# EAGLE schematic Trinket_TH_thru_parts_power_breakout (EAGLE 7.2.0)
Trinket_TH_thru_parts_power_breakout

## Sheet 1 of 8: Trinket_TH_thru_parts_power_breakout
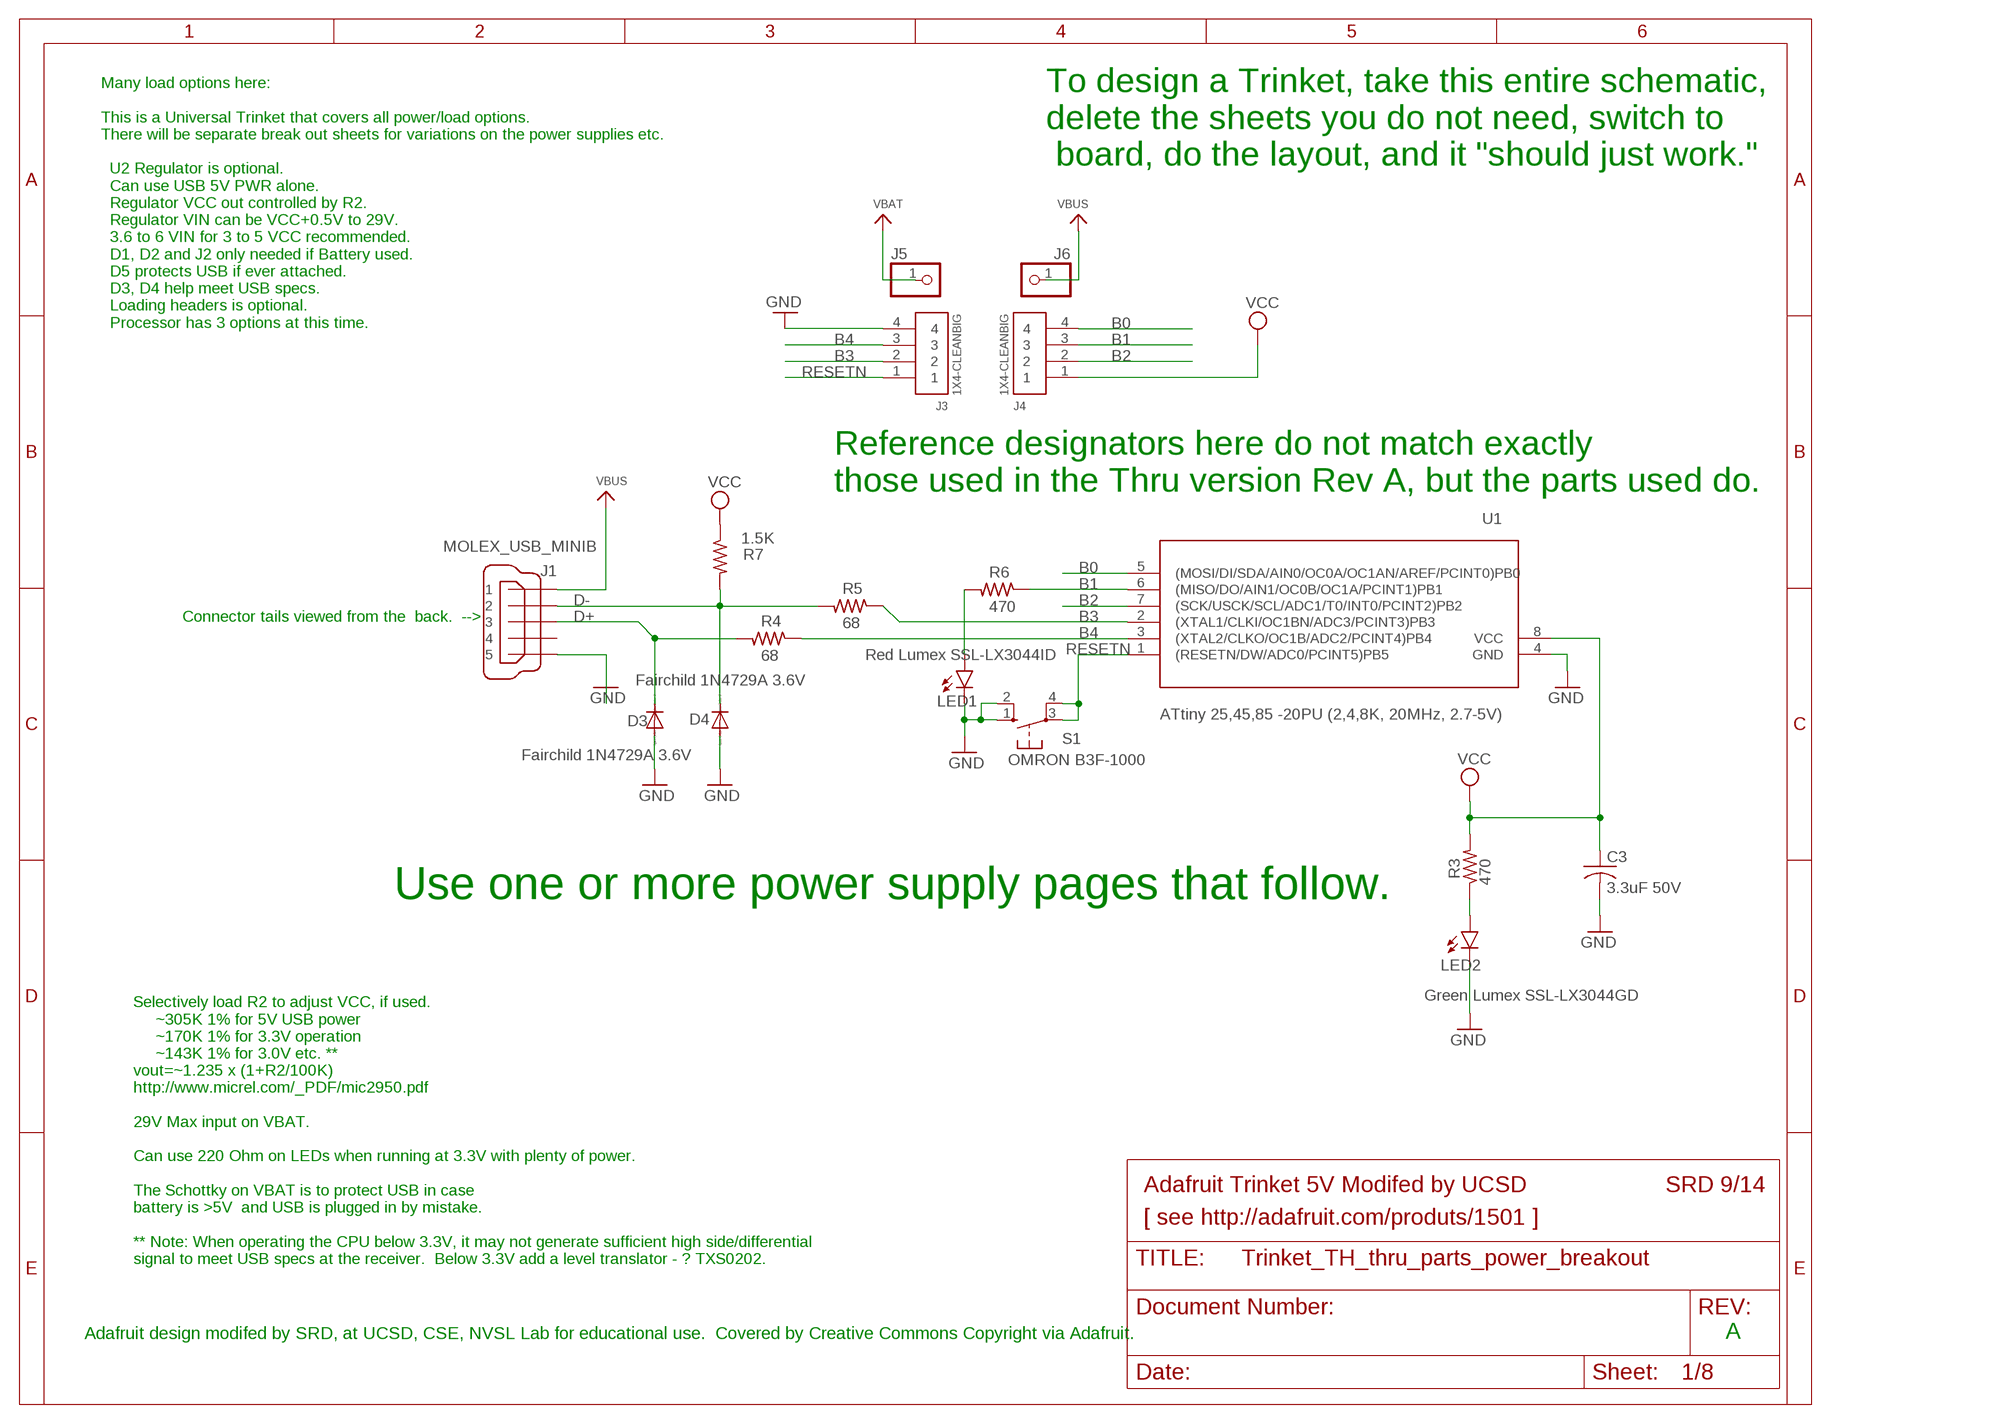
[diagram p0: schematic, sheet 1]

### Parts
C3  3.3uF 50V  C-US050-025X075  [C050-025X075]
D3  Fairchild 1N4729A 3.6V  DIODE-DO41-7.6  [DO41-7.6]
D4  Fairchild 1N4729A 3.6V  DIODE-DO41-7.6  [DO41-7.6]
J1  MOLEX_USB_MINIB  [32005-601-ROUND]
J3  1X4-CLEANBIG  [1X04-CLEANBIG]
J4  1X4-CLEANBIG  [1X04-CLEANBIG]
J5  PINHD-1X1CB  [1X01-CLEANBIG]
J6  PINHD-1X1CB  [1X01-CLEANBIG]
LED1  Red Lumex SSL-LX3044ID  LED3MM  [LED3MM]
LED2  Green Lumex SSL-LX3044GD  LED3MM  [LED3MM]
R3  470  R-US_0204/7  [0204/7]
R4  68  R-US_0204/7  [0204/7]
R5  68  R-US_0204/7  [0204/7]
R6  470  R-US_0204/7  [0204/7]
R7  1.5K  R-US_0204/7  [0204/7]
S1  OMRON B3F-1000  10-XX  [B3F-10XX]
U1  ATtiny 25,45,85 -20PU (2,4,8K, 20MHz, 2.7-5V)  ATTINY85-20P  [DIL08]

### Nets
B0: J4.4 U1.5((MOSI/DI/SDA/AIN0/OC0A/OC1AN/AREF/PCINT0)PB0)
B1: J4.3 R6.1 U1.6((MISO/DO/AIN1/OC0B/OC1A/PCINT1)PB1)
B2: J4.2 U1.7((SCK/USCK/SCL/ADC1/T0/INT0/PCINT2)PB2)
B3: J3.2 R5.1 U1.2((XTAL1/CLKI/OC1BN/ADC3/PCINT3)PB3)
B4: J3.3 R4.1 U1.3((XTAL2/CLKO/OC1B/ADC2/PCINT4)PB4)
D+: D3.C J1.3 R4.2
D-: D4.C J1.2 R5.2 R7.2
GND: C3.2 D3.A D4.A J1.5 J3.4 LED1.K(C) LED2.K(C) S1.1(S) S1.2(S1) U1.4(GND) ; also sheet 3,7,8
N$1: LED1.A R6.2
N$3: LED2.A R3.1
RESETN: J3.1 S1.3(P) S1.4(P1) U1.1((RESETN/DW/ADC0/PCINT5)PB5)
VBAT: J5.1 ; also sheet 2,3,8
VBUS: J1.1 J6.1 ; also sheet 3,7,8
VCC: C3.1 J4.1 R3.2 R7.1 U1.8(VCC) ; also sheet 2,3,4,5,6,7,8
Unconnected: J1.4 J1.M1(S1) J1.M2(S2)

### Notes on the sheet
- To design a Trinket, take this entire schematic,
  delete the sheets you do not need, switch to
   board, do the layout, and it "should just work."
- Many load options here:
  
  This is a Universal Trinket that covers all power/load options.
  There will be separate break out sheets for variations on the power supplies etc.
  
    U2 Regulator is optional.  
    Can use USB 5V PWR alone.
    Regulator VCC out controlled by R2.
    Regulator VIN can be VCC+0.5V to 29V.
    3.6 to 6 VIN for 3 to 5 VCC recommended.
    D1, D2 and J2 only needed if Battery used.
    D5 protects USB if ever attached.
    D3, D4 help meet USB specs.
    Loading headers is optional.
    Processor has 3 options at this time.
- Reference designators here do not match exactly
  those used in the Thru version Rev A, but the parts used do.
- Connector tails viewed from the  back.  -->
- Use one or more power supply pages that follow.
- Adafruit Trinket 5V Modifed by UCSD | SRD 9/14
- [ see http://adafruit.com/produts/1501 ]
- Selectively load R2 to adjust VCC, if used.
       ~305K 1% for 5V USB power
       ~170K 1% for 3.3V operation
       ~143K 1% for 3.0V etc. **
  vout=~1.235 x (1+R2/100K)
  http://www.micrel.com/_PDF/mic2950.pdf
  
  29V Max input on VBAT.
  
  Can use 220 Ohm on LEDs when running at 3.3V with plenty of power.
  
  The Schottky on VBAT is to protect USB in case 
  battery is >5V  and USB is plugged in by mistake.
  
  ** Note: When operating the CPU below 3.3V, it may not generate sufficient high side/differential
  signal to meet USB specs at the receiver.  Below 3.3V add a level translator - ? TXS0202.
- Adafruit design modifed by SRD, at UCSD, CSE, NVSL Lab for educational use.  Covered by Creative Commons Copyright via Adafruit. | A

## Sheet 2 of 8
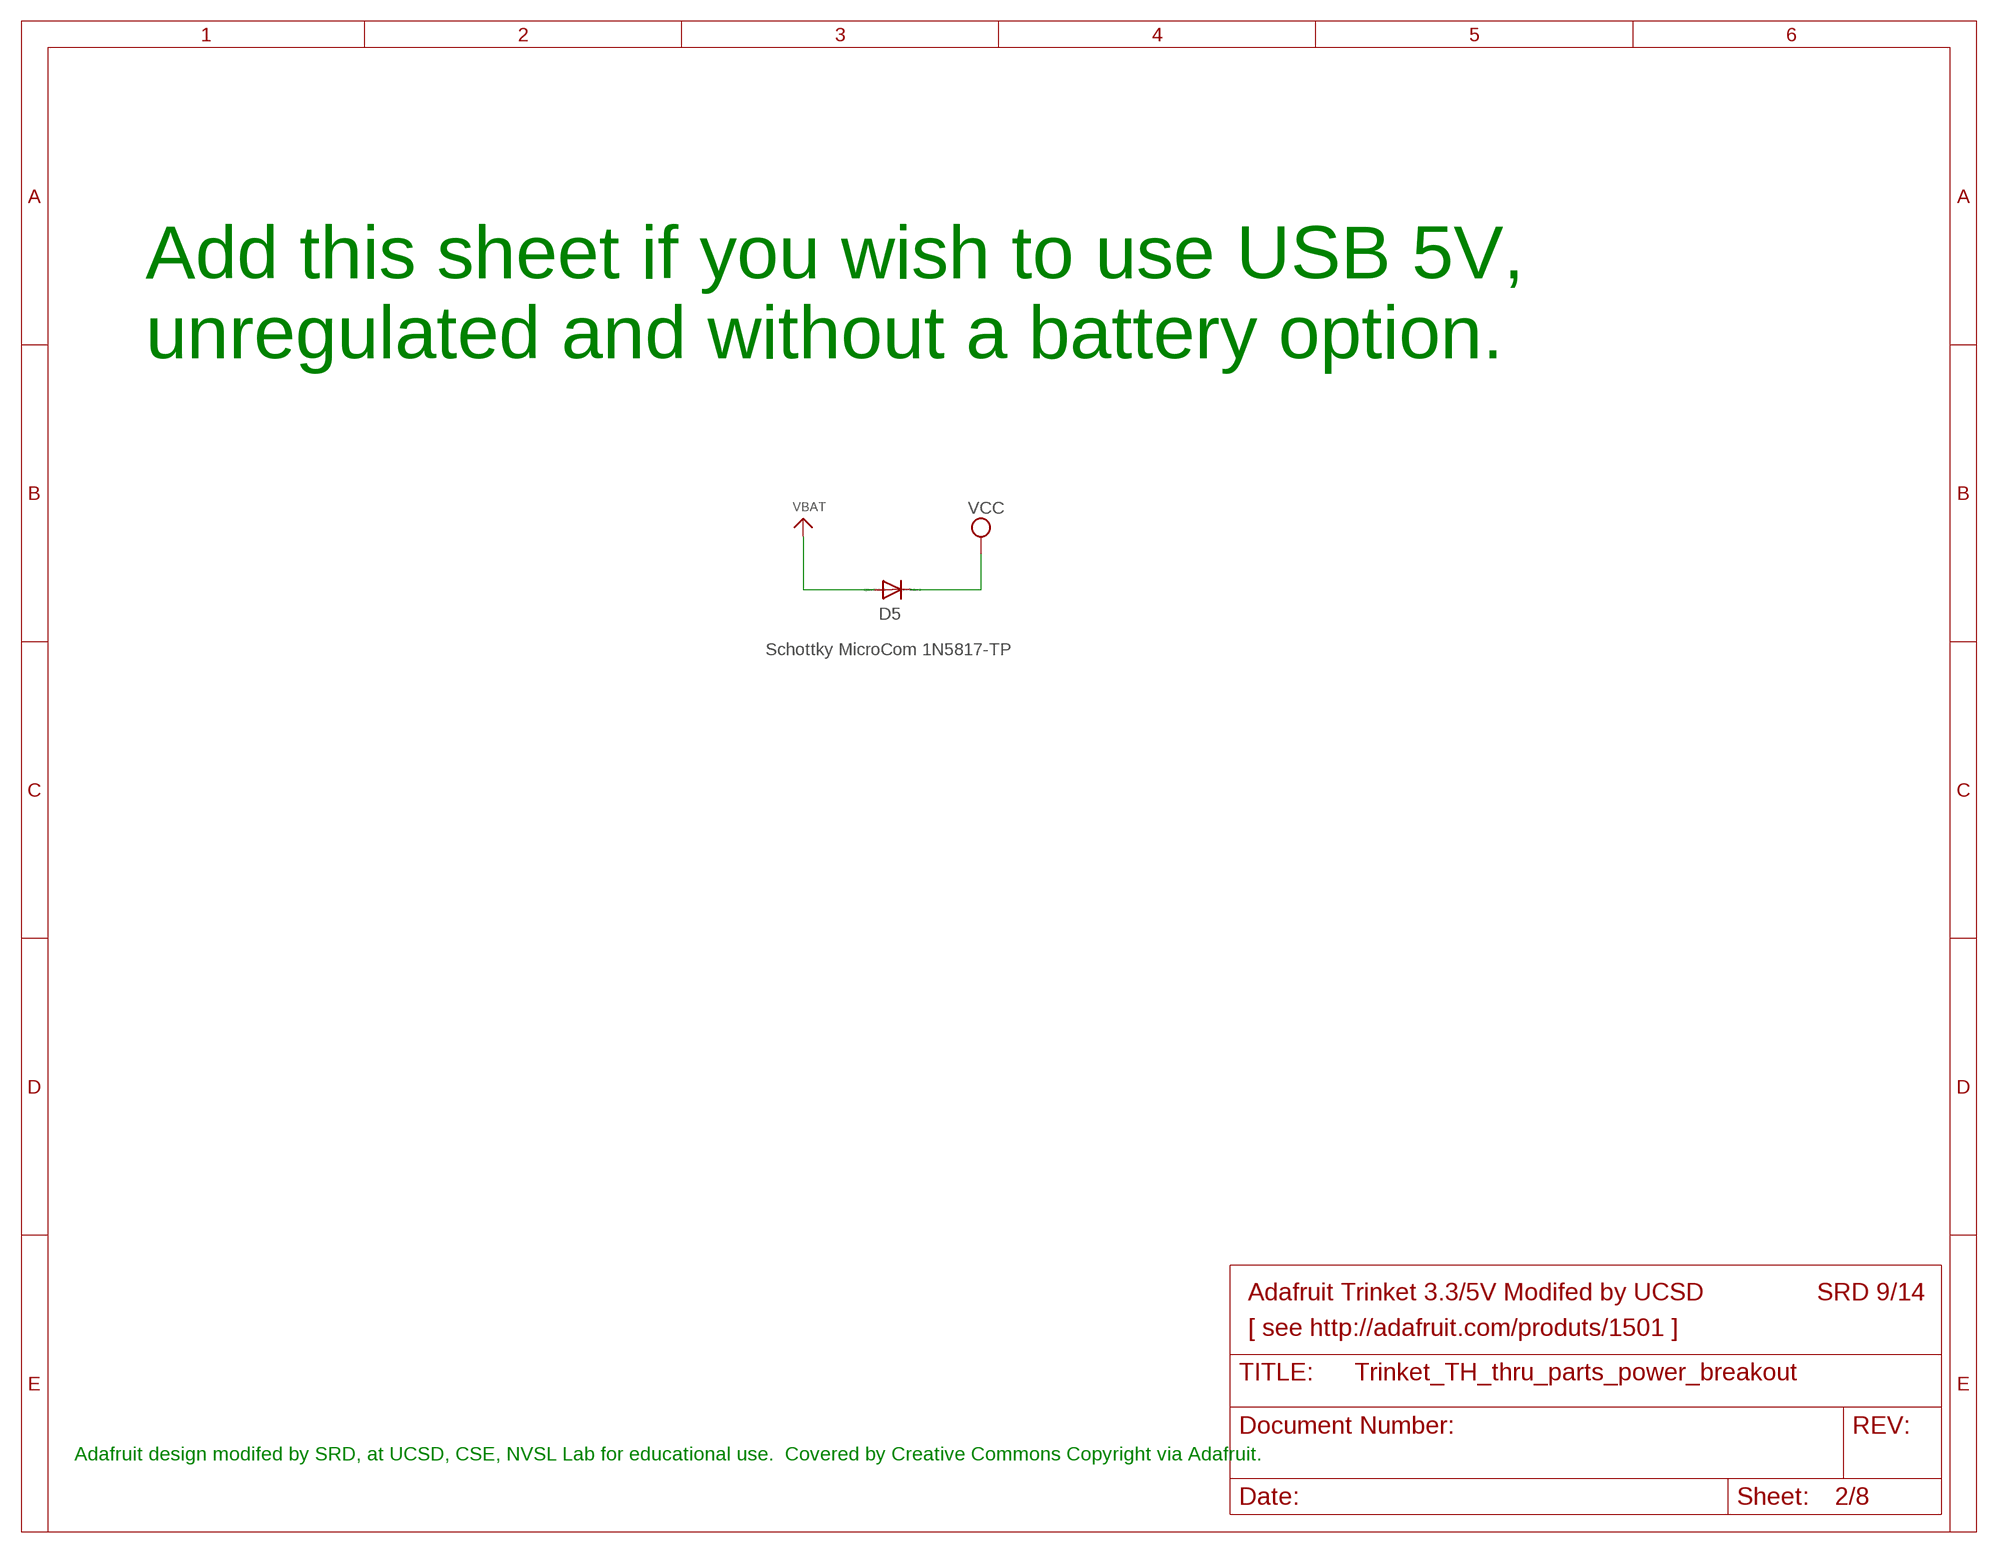
[diagram p1: schematic, sheet 2]

### Parts
D5  Schottky MicroCom 1N5817-TP  DIODE-DO41-7.6  [DO41-7.6]

### Nets
VBAT: D5.A ; also sheet 1,3,8
VCC: D5.C ; also sheet 1,3,4,5,6,7,8

### Notes on the sheet
- Add this sheet if you wish to use USB 5V,
  unregulated and without a battery option.
- Adafruit Trinket 3.3/5V Modifed by UCSD | SRD 9/14
- [ see http://adafruit.com/produts/1501 ]
- Adafruit design modifed by SRD, at UCSD, CSE, NVSL Lab for educational use.  Covered by Creative Commons Copyright via Adafruit.

## Sheet 3 of 8
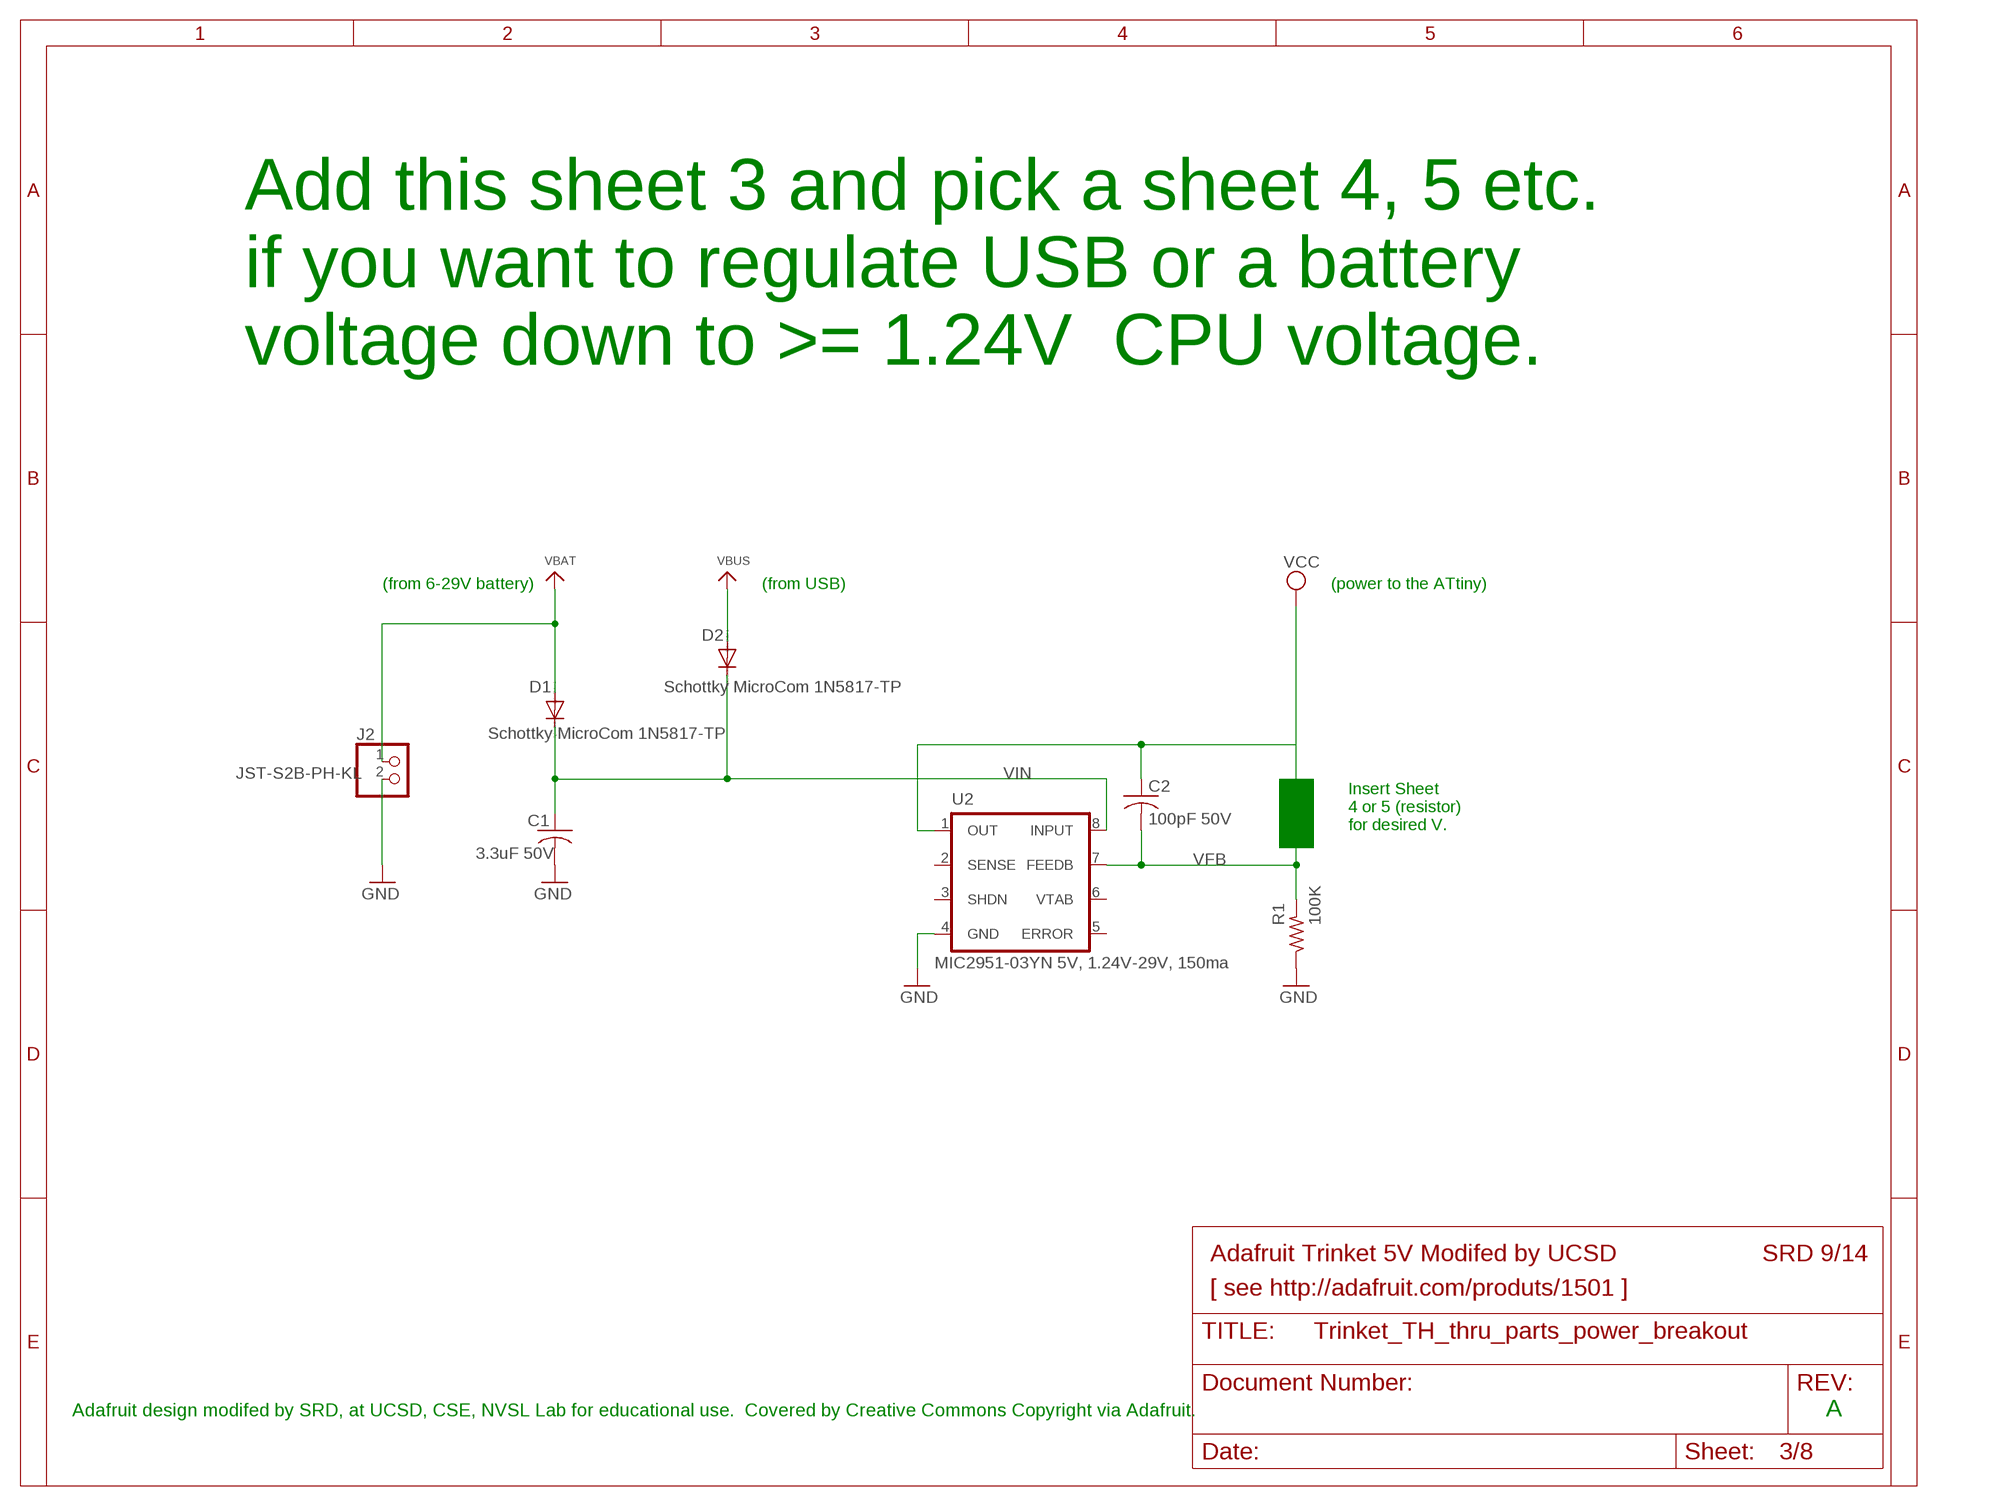
[diagram p2: schematic, sheet 3]

### Parts
C1  3.3uF 50V  C-US050-025X075  [C050-025X075]
C2  100pF 50V  C-US050-025X075  [C050-025X075]
D1  Schottky MicroCom 1N5817-TP  DIODE-DO41-7.6  [DO41-7.6]
D2  Schottky MicroCom 1N5817-TP  DIODE-DO41-7.6  [DO41-7.6]
J2  JST-S2B-PH-KL  CON_JST_PH_2PINJST_S2B_PH_KL  [JST_S2B_PH_KL]
R1  100K  R-US_0204/7  [0204/7]
U2  MIC2951-03YN 5V, 1.24V-29V, 150ma  MIC2951-03YNCN  [DIL08]

### Nets
GND: C1.2 J2.2 R1.1 U2.4(GND) ; also sheet 1,7,8
VBAT: D1.A J2.1 ; also sheet 1,2,8
VBUS: D2.A ; also sheet 1,7,8
VCC: C2.1 U2.1(OUT) ; also sheet 1,2,4,5,6,7,8
VFB: C2.2 R1.2 U2.7(FEEDB) ; also sheet 4,5,6,7,8
VIN: C1.1 D1.C D2.C U2.8(INPUT) ; also sheet 7,8
Unconnected: U2.2(SENSE) U2.3(SHDN) U2.5(ERROR) U2.6(VTAB)

### Notes on the sheet
- Add this sheet 3 and pick a sheet 4, 5 etc.
  if you want to regulate USB or a battery
  voltage down to >= 1.24V  CPU voltage.
- (from 6-29V battery) | (from USB) | (power to the ATtiny)
- Insert Sheet
  4 or 5 (resistor)
  for desired V.
- Adafruit Trinket 5V Modifed by UCSD | SRD 9/14
- [ see http://adafruit.com/produts/1501 ]
- Adafruit design modifed by SRD, at UCSD, CSE, NVSL Lab for educational use.  Covered by Creative Commons Copyright via Adafruit. | A

## Sheet 4 of 8
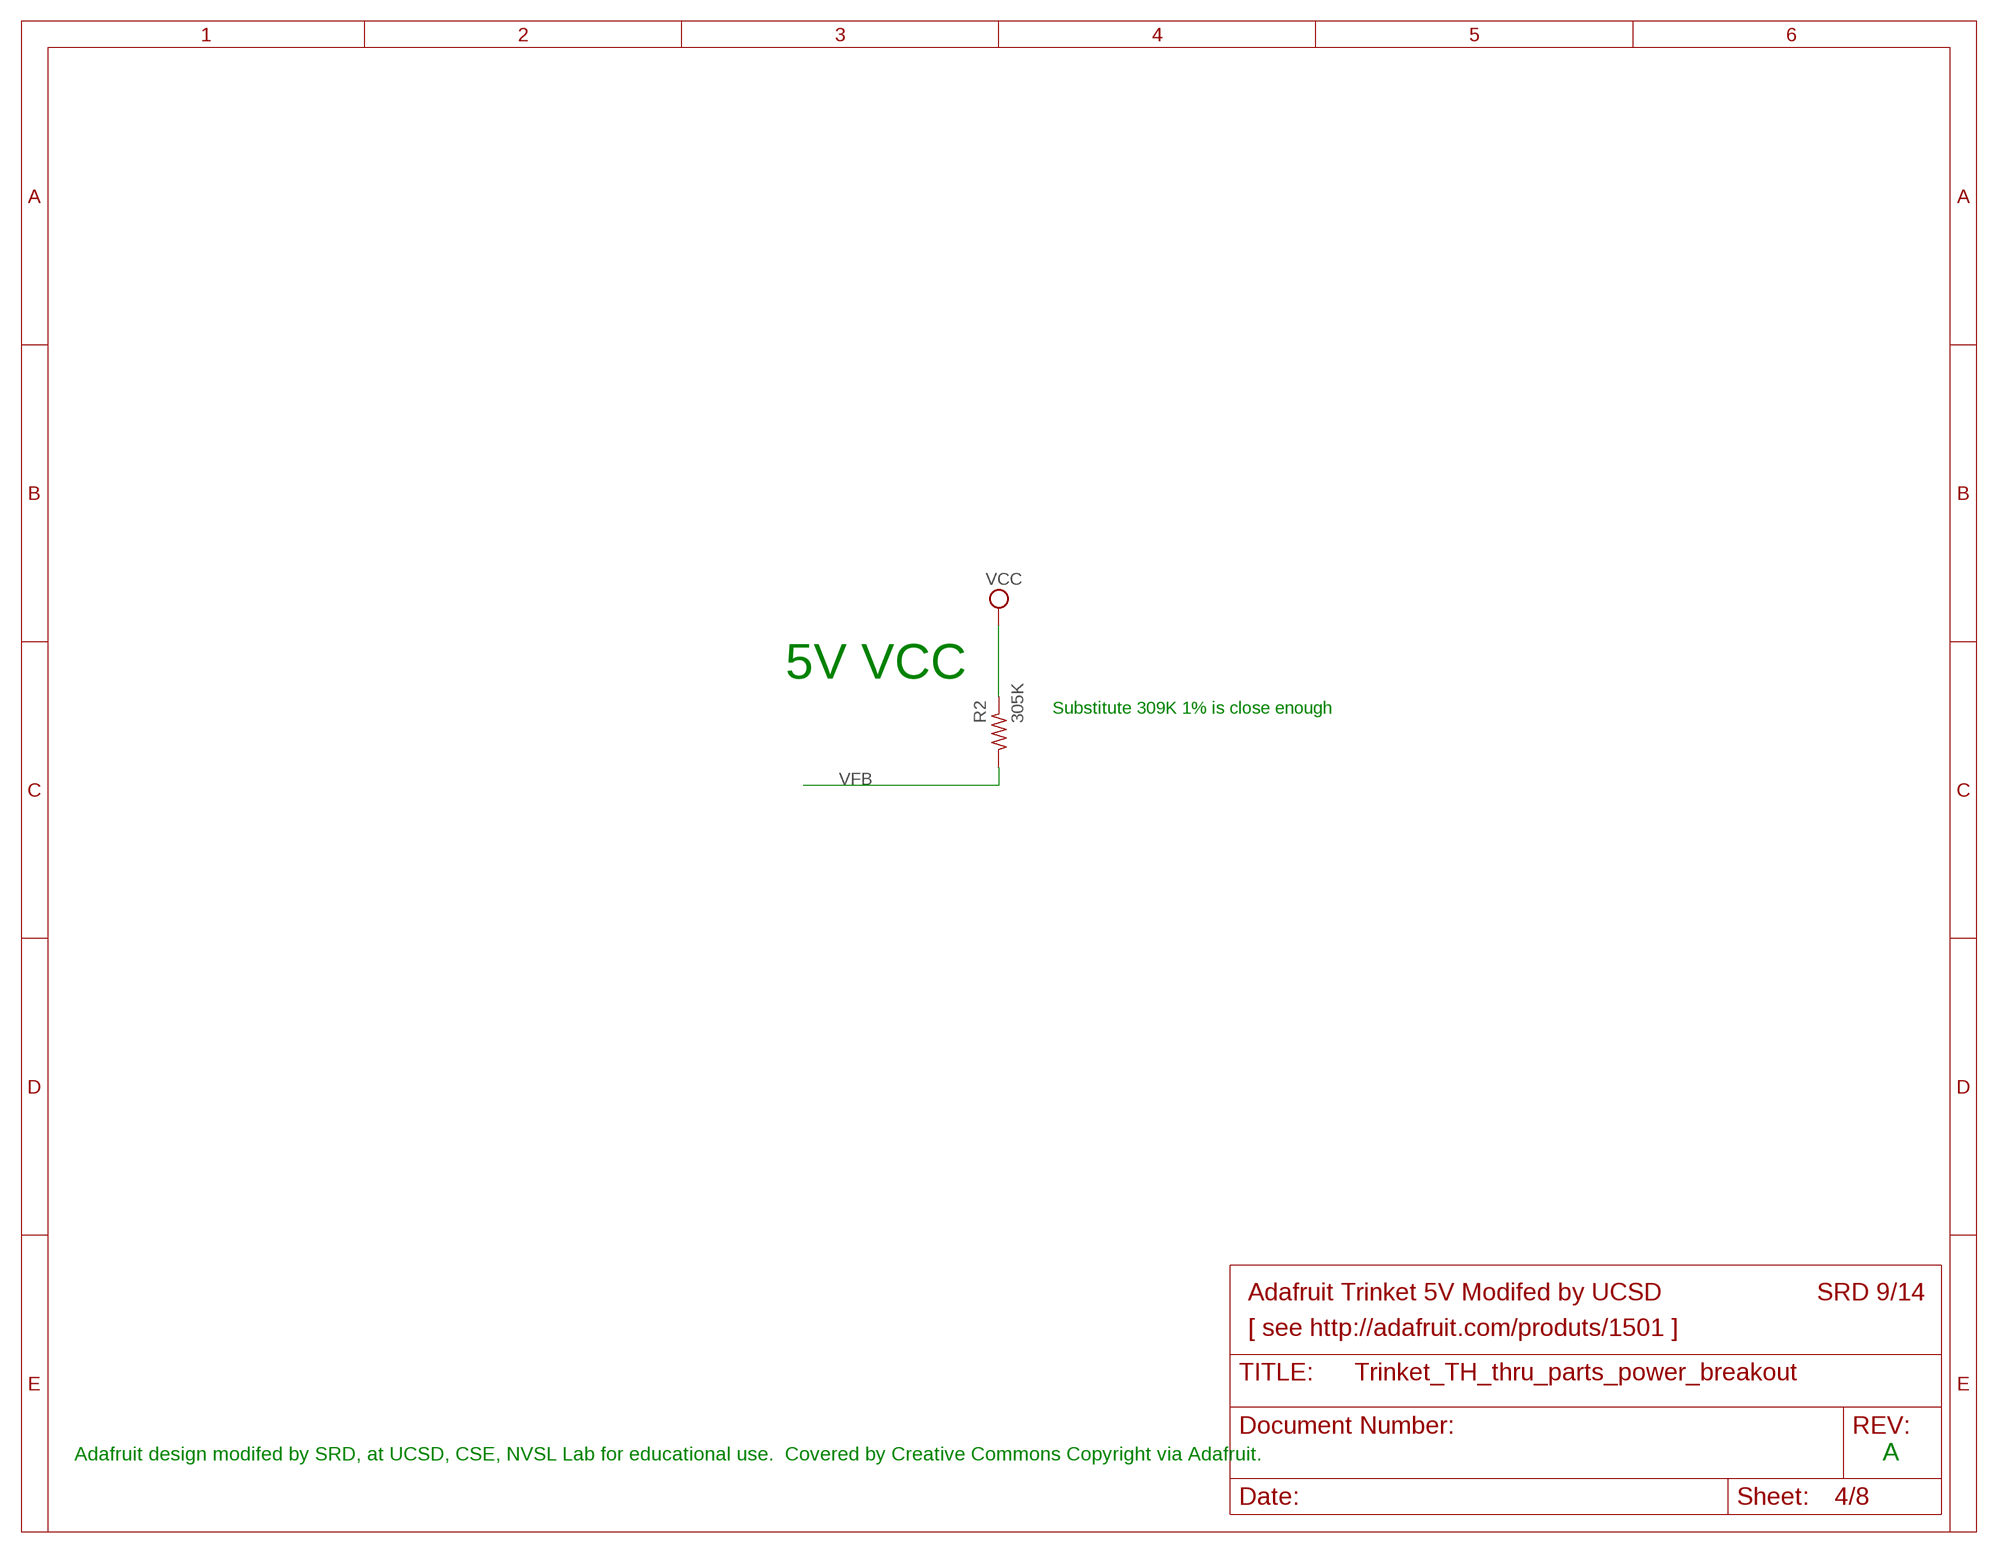
[diagram p3: schematic, sheet 4]

### Parts
R2  305K  R-US_0204/7  [0204/7]

### Nets
VCC: R2.2 ; also sheet 1,2,3,5,6,7,8
VFB: R2.1 ; also sheet 3,5,6,7,8

### Notes on the sheet
- 5V VCC
- Substitute 309K 1% is close enough
- Adafruit Trinket 5V Modifed by UCSD | SRD 9/14
- [ see http://adafruit.com/produts/1501 ]
- Adafruit design modifed by SRD, at UCSD, CSE, NVSL Lab for educational use.  Covered by Creative Commons Copyright via Adafruit. | A

## Sheet 5 of 8
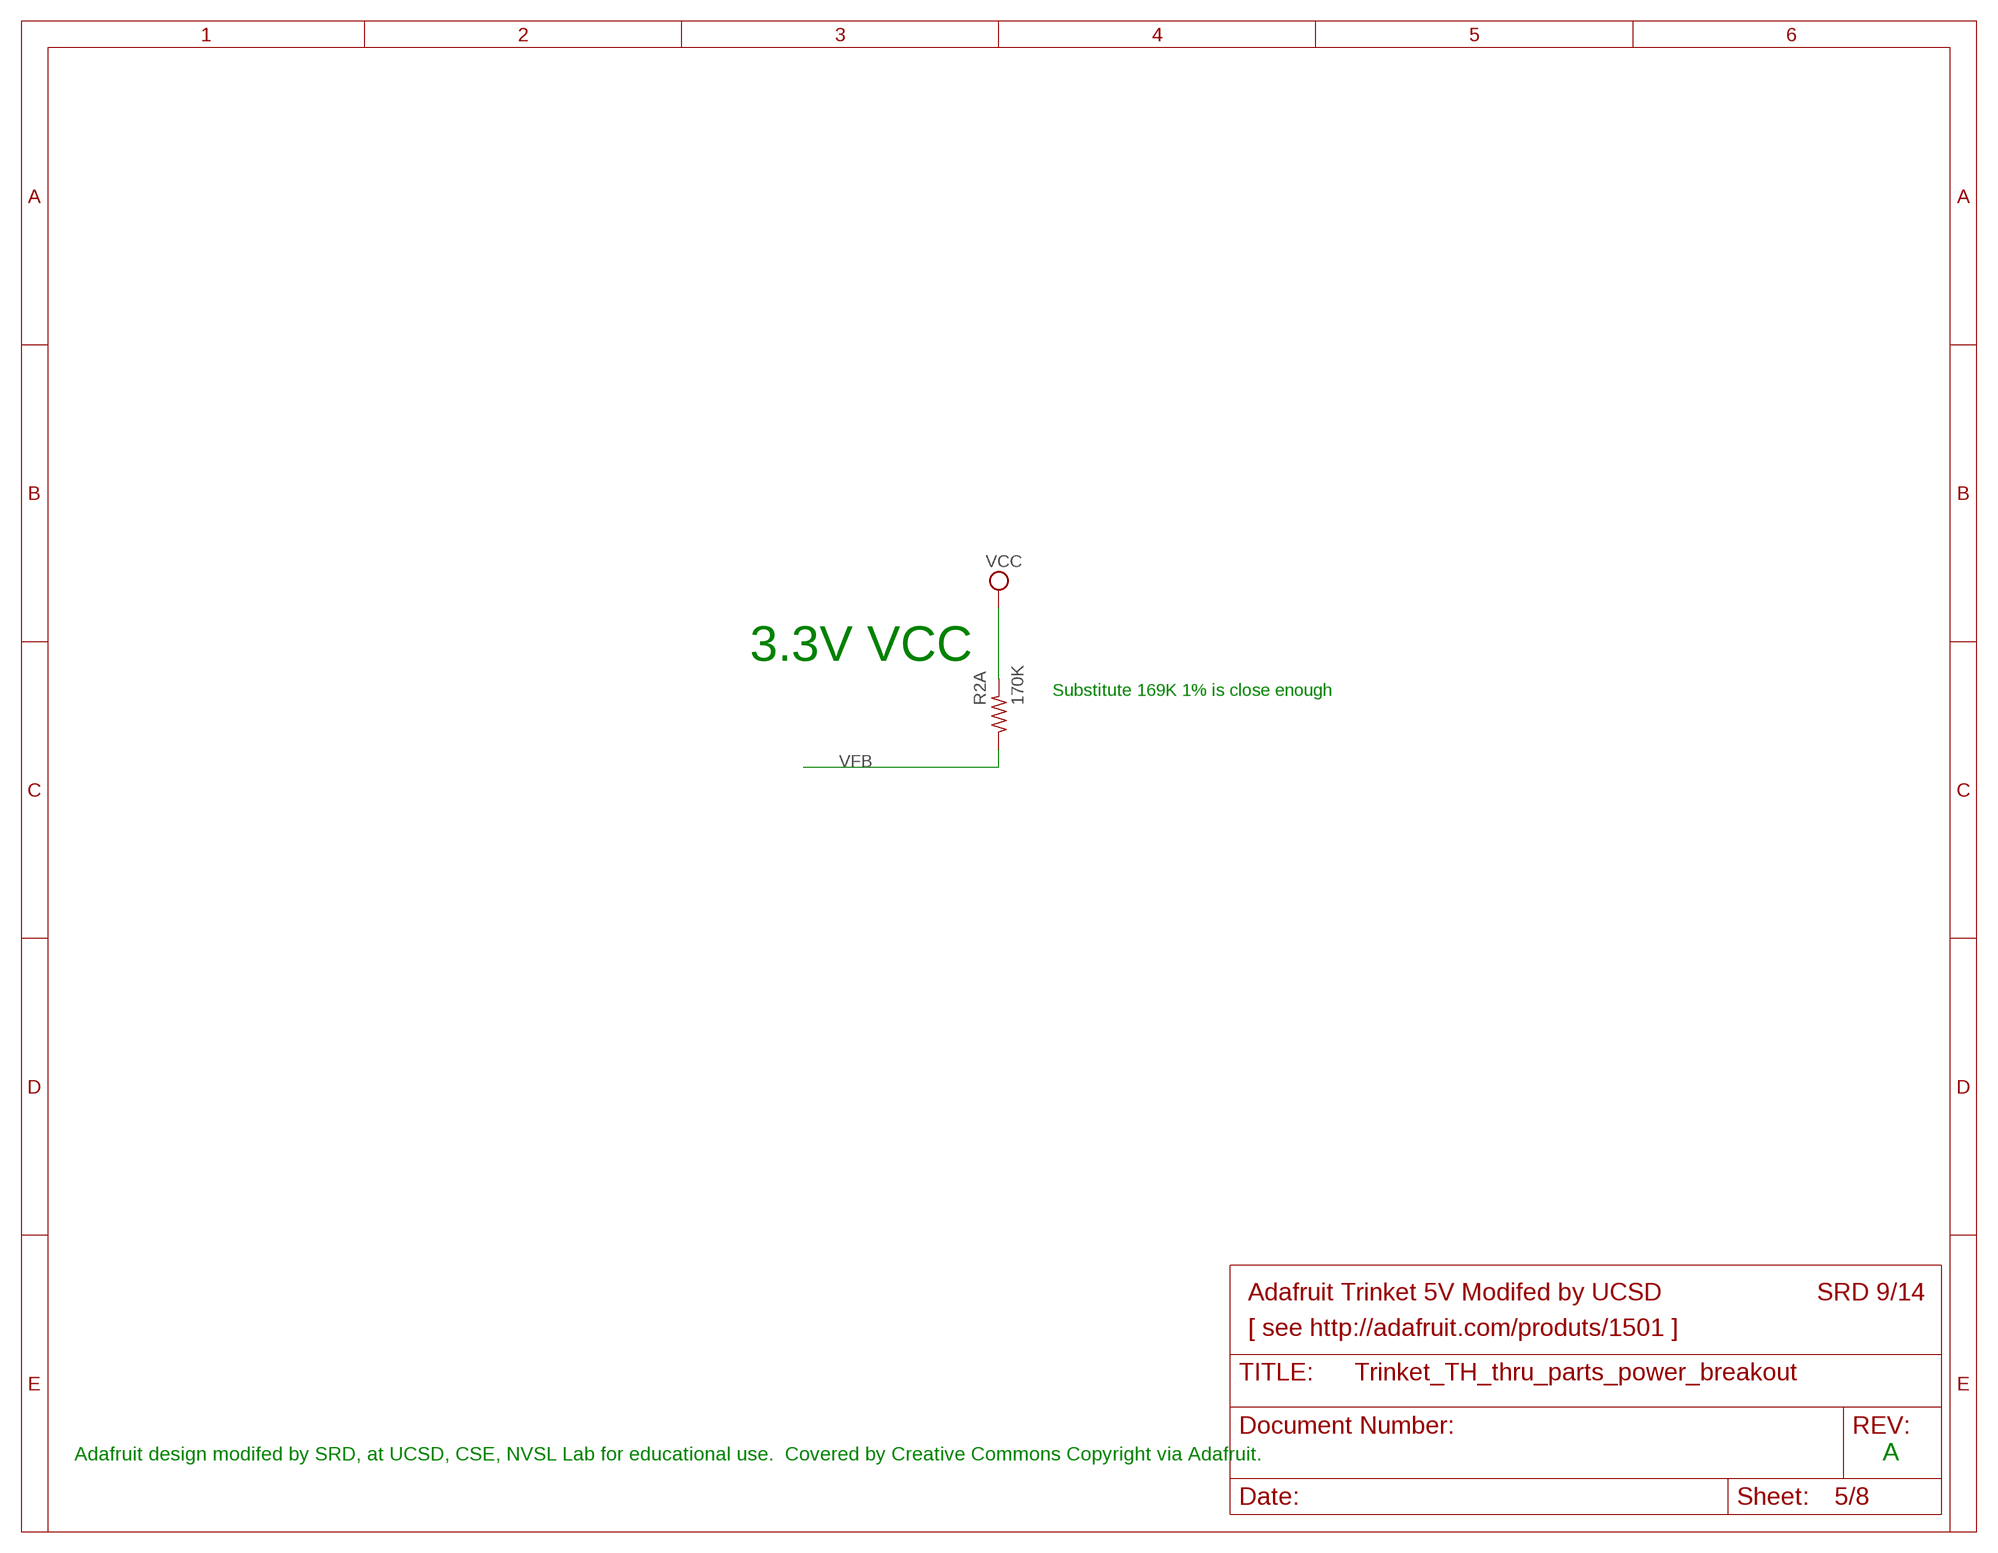
[diagram p4: schematic, sheet 5]

### Parts
R2A  170K  R-US_0204/7  [0204/7]

### Nets
VCC: R2A.2 ; also sheet 1,2,3,4,6,7,8
VFB: R2A.1 ; also sheet 3,4,6,7,8

### Notes on the sheet
- 3.3V VCC
- Substitute 169K 1% is close enough
- Adafruit Trinket 5V Modifed by UCSD | SRD 9/14
- [ see http://adafruit.com/produts/1501 ]
- Adafruit design modifed by SRD, at UCSD, CSE, NVSL Lab for educational use.  Covered by Creative Commons Copyright via Adafruit. | A

## Sheet 6 of 8
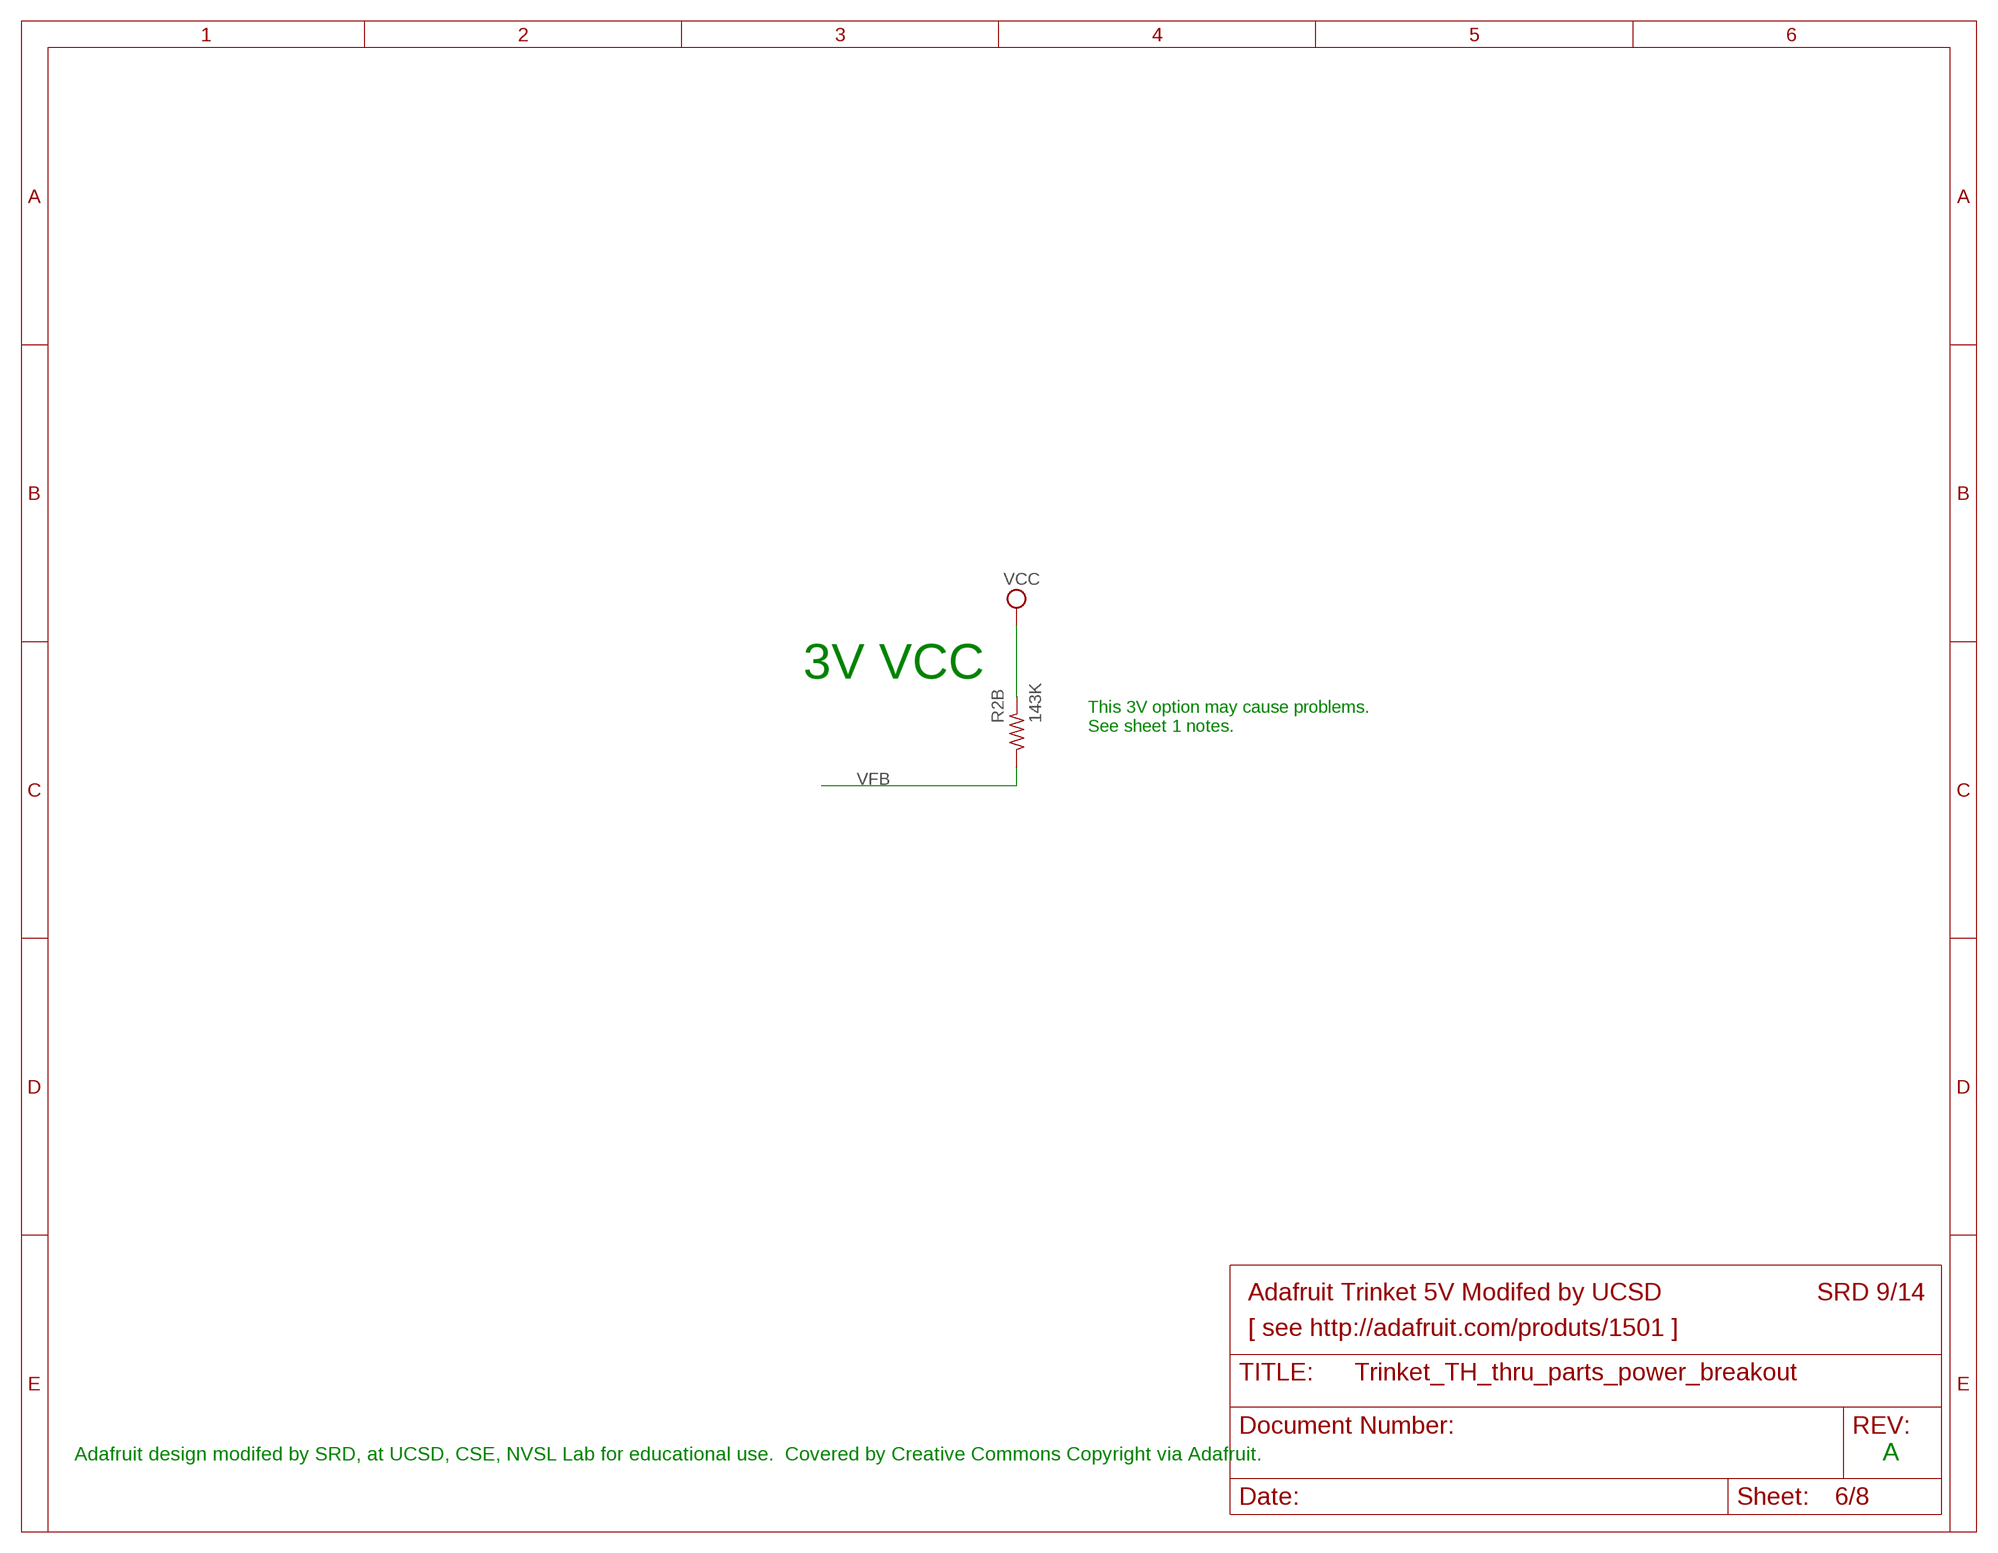
[diagram p5: schematic, sheet 6]

### Parts
R2B  143K  R-US_0204/7  [0204/7]

### Nets
VCC: R2B.2 ; also sheet 1,2,3,4,5,7,8
VFB: R2B.1 ; also sheet 3,4,5,7,8

### Notes on the sheet
- 3V VCC
- This 3V option may cause problems.
  See sheet 1 notes.
- Adafruit Trinket 5V Modifed by UCSD | SRD 9/14
- [ see http://adafruit.com/produts/1501 ]
- Adafruit design modifed by SRD, at UCSD, CSE, NVSL Lab for educational use.  Covered by Creative Commons Copyright via Adafruit. | A

## Sheet 7 of 8
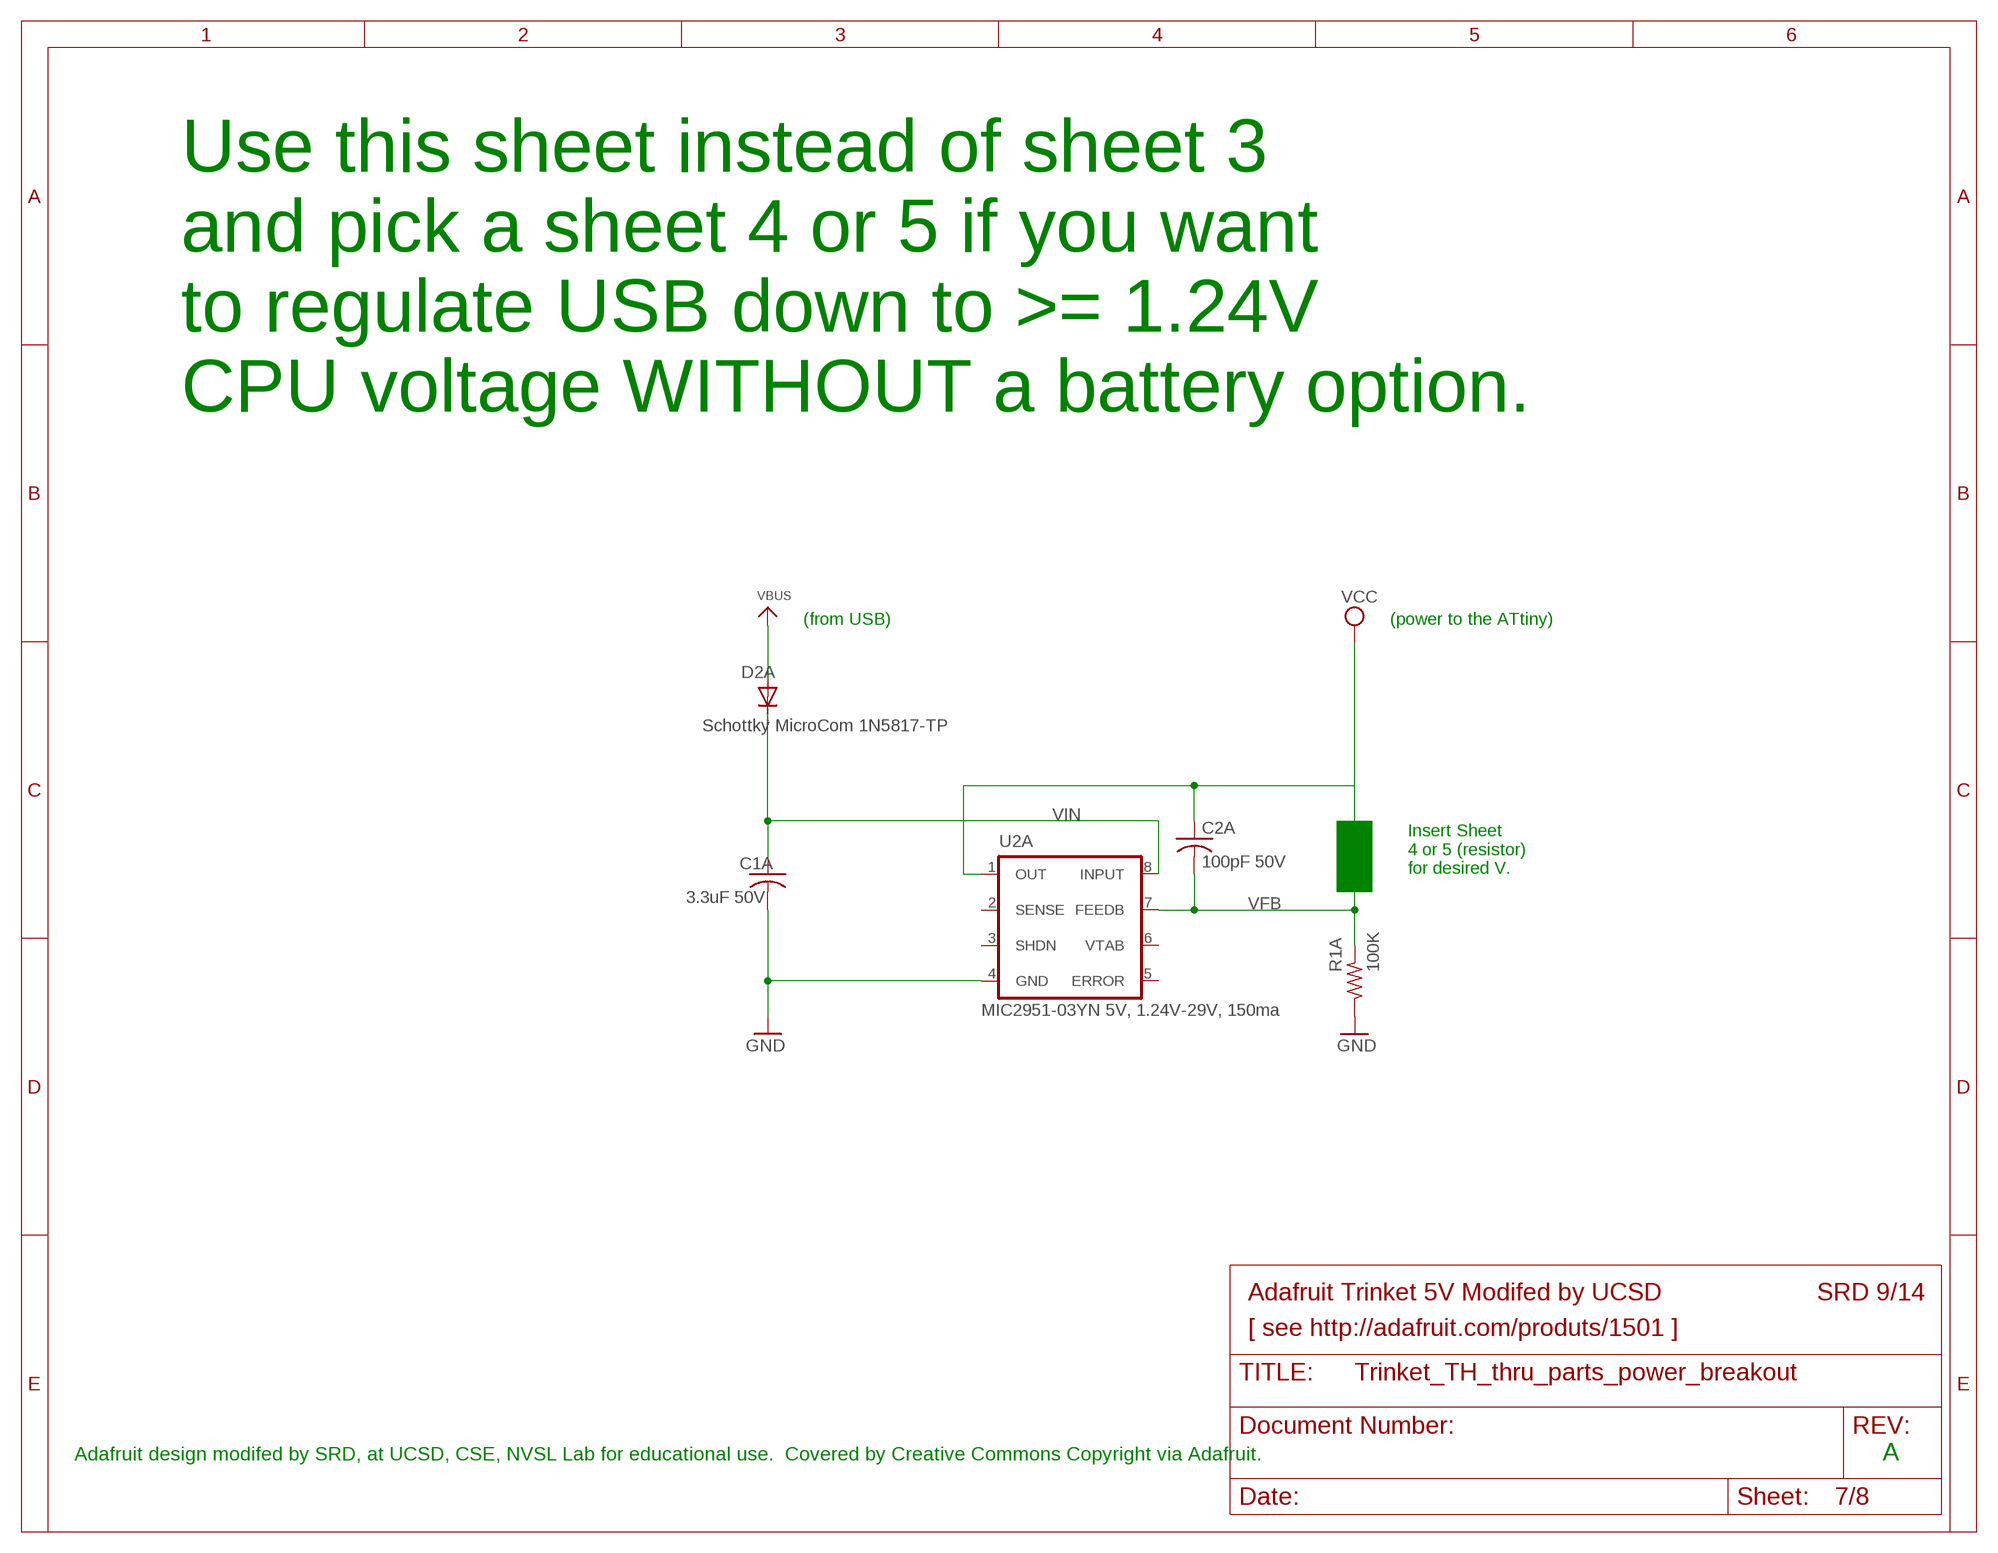
[diagram p6: schematic, sheet 7]

### Parts
C1A  3.3uF 50V  C-US050-025X075  [C050-025X075]
C2A  100pF 50V  C-US050-025X075  [C050-025X075]
D2A  Schottky MicroCom 1N5817-TP  DIODE-DO41-7.6  [DO41-7.6]
R1A  100K  R-US_0204/7  [0204/7]
U2A  MIC2951-03YN 5V, 1.24V-29V, 150ma  MIC2951-03YNCN  [DIL08]

### Nets
GND: C1A.2 R1A.1 U2A.4(GND) ; also sheet 1,3,8
VBUS: D2A.A ; also sheet 1,3,8
VCC: C2A.1 U2A.1(OUT) ; also sheet 1,2,3,4,5,6,8
VFB: C2A.2 R1A.2 U2A.7(FEEDB) ; also sheet 3,4,5,6,8
VIN: C1A.1 D2A.C U2A.8(INPUT) ; also sheet 3,8
Unconnected: U2A.2(SENSE) U2A.3(SHDN) U2A.5(ERROR) U2A.6(VTAB)

### Notes on the sheet
- Use this sheet instead of sheet 3
  and pick a sheet 4 or 5 if you want 
  to regulate USB down to >= 1.24V 
  CPU voltage WITHOUT a battery option.
- (from USB) | (power to the ATtiny)
- Insert Sheet
  4 or 5 (resistor)
  for desired V.
- Adafruit Trinket 5V Modifed by UCSD | SRD 9/14
- [ see http://adafruit.com/produts/1501 ]
- Adafruit design modifed by SRD, at UCSD, CSE, NVSL Lab for educational use.  Covered by Creative Commons Copyright via Adafruit. | A

## Sheet 8 of 8
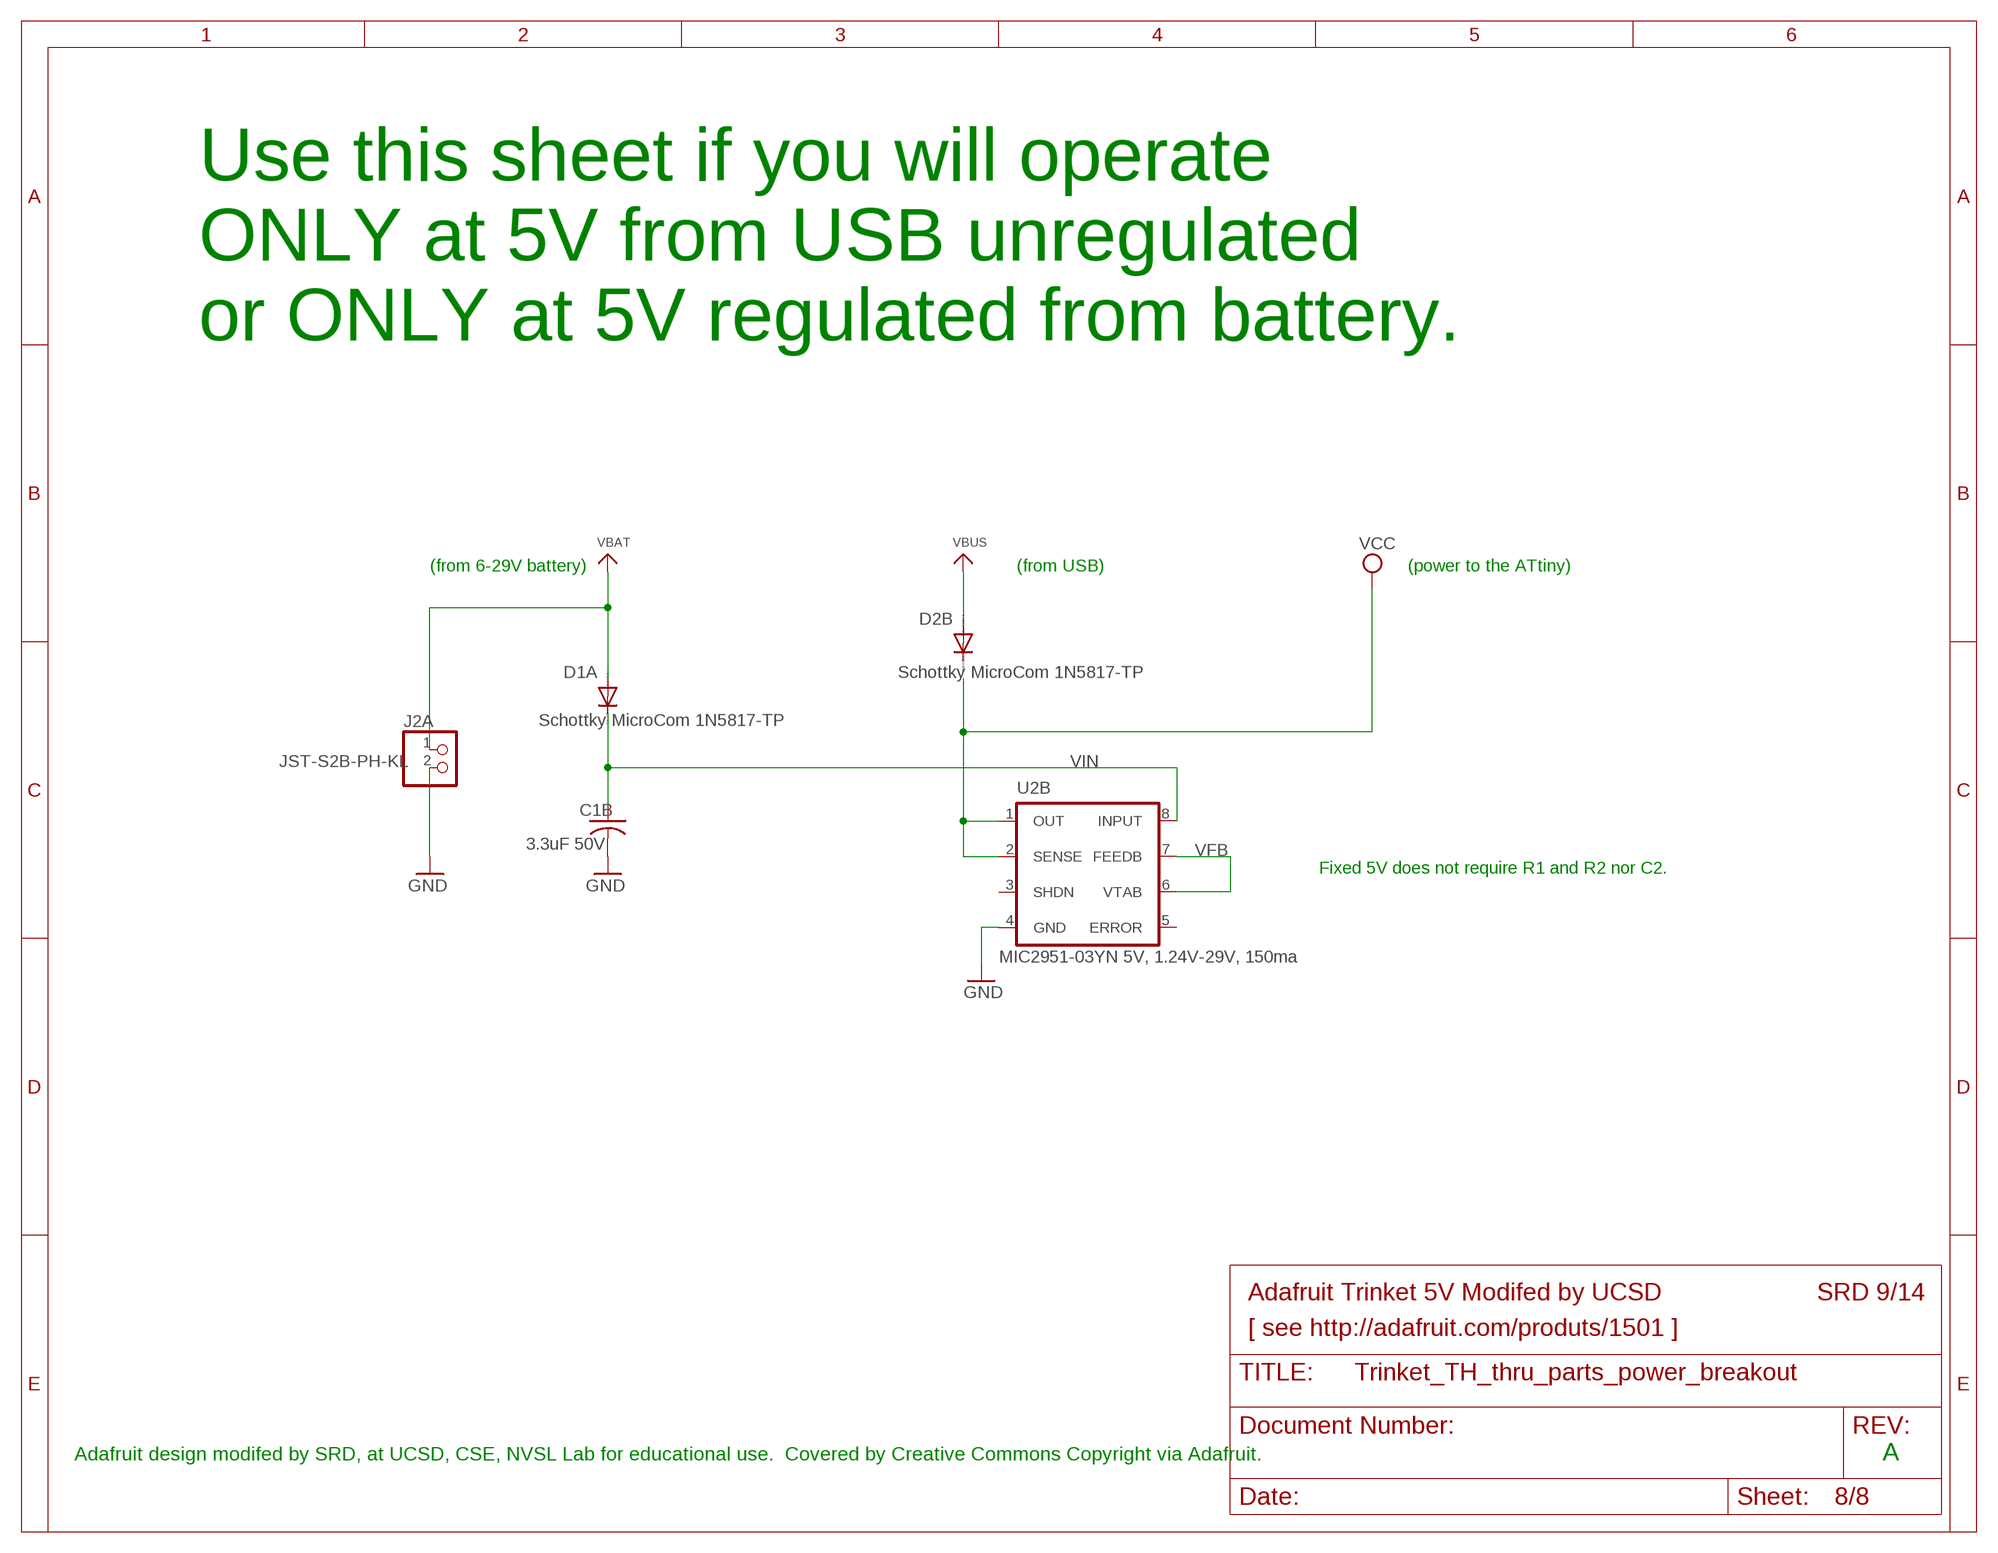
[diagram p7: schematic, sheet 8]

### Parts
C1B  3.3uF 50V  C-US050-025X075  [C050-025X075]
D1A  Schottky MicroCom 1N5817-TP  DIODE-DO41-7.6  [DO41-7.6]
D2B  Schottky MicroCom 1N5817-TP  DIODE-DO41-7.6  [DO41-7.6]
J2A  JST-S2B-PH-KL  CON_JST_PH_2PINJST_S2B_PH_KL  [JST_S2B_PH_KL]
U2B  MIC2951-03YN 5V, 1.24V-29V, 150ma  MIC2951-03YNCN  [DIL08]

### Nets
GND: C1B.2 J2A.2 U2B.4(GND) ; also sheet 1,3,7
VBAT: D1A.A J2A.1 ; also sheet 1,2,3
VBUS: D2B.A ; also sheet 1,3,7
VCC: U2B.1(OUT) U2B.2(SENSE) ; also sheet 1,2,3,4,5,6,7
VFB: U2B.6(VTAB) U2B.7(FEEDB) ; also sheet 3,4,5,6,7
VIN: C1B.1 D1A.C U2B.8(INPUT) ; also sheet 3,7
Unconnected: D2B.C U2B.3(SHDN) U2B.5(ERROR)

### Notes on the sheet
- Use this sheet if you will operate
  ONLY at 5V from USB unregulated
  or ONLY at 5V regulated from battery.
- (from 6-29V battery) | (from USB) | (power to the ATtiny)
- Fixed 5V does not require R1 and R2 nor C2.
- Adafruit Trinket 5V Modifed by UCSD | SRD 9/14
- [ see http://adafruit.com/produts/1501 ]
- Adafruit design modifed by SRD, at UCSD, CSE, NVSL Lab for educational use.  Covered by Creative Commons Copyright via Adafruit. | A

## Library data of the parts
C1 C1A C1B C3 = resistor:C-US: CAPACITOR, American symbol; DIST-1: DigiKey; DIST-1-PN: 445-8459-ND; MFR: TDK; PARTNO: FK20X7R1H335K; TOL: 10%; VOLT: 50V
C2 C2A = resistor:C-US: CAPACITOR, American symbol; DIST-1: DigiKey; DIST-1-PN: 445-4726-ND; MFR: TDK; PARTNO: FK28C0G1H101J; TOL: 10%; VOLT: 50V
D1 D1A D2 D2A D2B D5 = diode:DIODE-: DIODE; DIST-1: DigiKey; DIST-1-PN: 1N5817-TPCT-ND; MFR: Micro Com.; PARTNO: 1N5817-TP; TYPE: Schottky
D3 D4 = diode:DIODE-: DIODE; DIST-1: DigiKey; DIST-1-PN: 1N4729AFS-ND; MFR: Fairchild; PARTNO: 1N4729A; TYPE: Zener
J1 = Trinket TH:MOLEX_USB_MINIB: MINI USB-B R/A DIP 5pol. Molex 0548190519; DIST-1: DigiKey; DIST-1-PN: WM17115-ND; MFR: Molex; PARTNO: 0548190519
J2 J2A = Adafruit Trinket 5V:CON_JST_PH_2PIN: JST 2-Pin Right-Angle Connector PH-Series - 4UConnector: 17311 SH-Series - 4UConnector: 07278; DIST-1: DigiKey; DIST-1-PN: 455-1719-ND; MFR: JST; PARTNO: JST_S2B_PH_KL
J3 J4 = adafruit:1X4: 4-pin connector; BOM: EXCLUDE; DNP: T
J5 J6 = adafruit:PINHD-1X1: Pin header 1x1 for 0.1" spacing With round pins; BOM: EXCLUDE; DNP: T
LED1 = SparkFun-LED:LED: LEDs Standard schematic elements and footprints for 5mm, 3mm, 1206, and 0603 sized LEDs. 5mm - Spark Fun Electronics SKU : COM-00529 (and others); COLOR: RED; DIST-1: DigiKey; DIST-1-PN: 67-1066-ND; MFR: Lumex; PARTNO: SSL-LX3044ID
LED2 = SparkFun-LED:LED: LEDs Standard schematic elements and footprints for 5mm, 3mm, 1206, and 0603 sized LEDs. 5mm - Spark Fun Electronics SKU : COM-00529 (and others); COLOR: GREEN; DIST-1: DigiKey; DIST-1-PN: 67-1060-ND; MFR: Lumex; PARTNO: SSL-LX3044GD
R1 R1A = Adafruit Trinket 5V:R-US_: RESISTOR, American symbol; DIST-1: DigiKey; DIST-1-PN: 100KXBK-ND; MFR: Yageo; PARTNO: MFR-25FBF52-100K; RATE: 1/4W; TOL: 1%
R2 = Adafruit Trinket 5V:R-US_: RESISTOR, American symbol; DIST-1: DigiKey; DIST-1-PN: 301KXBK-ND; MFR: Yageo; PARTNO: MFR-25FBF52-301K; PLACE: for 5V only; RATE: 1/4W; TOL: 1%
R2A = Adafruit Trinket 5V:R-US_: RESISTOR, American symbol; DIST-1: DigiKey; DIST-1-PN: 169KXBK-ND; MFR: Yageo; PARTNO: MFR-25FBF52-169K; PLACE: for 3.6V only; RATE: 1/4W; TOL: 1%
R2B = Adafruit Trinket 5V:R-US_: RESISTOR, American symbol; DIST-1: DigiKey; DIST-1-PN: 143KXBK-ND; MFR: Yageo; PARTNO: MFR-25FBF52-143K; PLACE: for 3.0V only; RATE: 1/4W; TOL: 1%
R3 R6 = Adafruit Trinket 5V:R-US_: RESISTOR, American symbol; DIST-1: DigiKey; DIST-1-PN: 470EBK-ND; MFR: Yageo; PARTNO: CFR-12JB-52-470R; RATE: 1/6W; TOL: 5%
R4 R5 = Adafruit Trinket 5V:R-US_: RESISTOR, American symbol; DIST-1: DigiKey; DIST-1-PN: 68EBK-ND; MFR: Yageo; PARTNO: CFR-12JB-52-68R; RATE: 1/6W; TOL: 5%
R7 = Adafruit Trinket 5V:R-US_: RESISTOR, American symbol; DIST-1: DigiKey; DIST-1-PN: 1.5KEBK-ND; MFR: Yageo; PARTNO: CFR-12JB-52-1K5; RATE: 1/6W; TOL: 5%
S1 = switch-omron:10-XX: OMRON SWITCH; DIST-1: DigiKey; DIST-1-PN: SW400-ND; MFR: Omron; PARTNO: B3F-1000
U1 = Trinket TH:ATTINY85: MICROCONTROLLER 8 Kbytes FLASH 512 bytes EEPROM 512 bytes RAM 4-channel 10 bit ADC USI; DIST-1: DigiKey; DIST-1-PN: ATTINY85-20PU-ND; MFR: Atmel; PARTNO: ATTINY85-20PU-ND
U2 U2A U2B = Adafruit Trinket 5V TH:MIC2951-03YN: Adjustable Micropower Voltage Regulator Source: http://cache.national.com/ds/LP/LP2950.pdf; DIST-1: DigiKey; DIST-1-PN: 576-1150-ND; MFR: Micrel; PARTNO: MIC2951-03YN

## Net classes
1 power: width 0.305 mm